# EAGLE design sensorring (EAGLE 6.3)
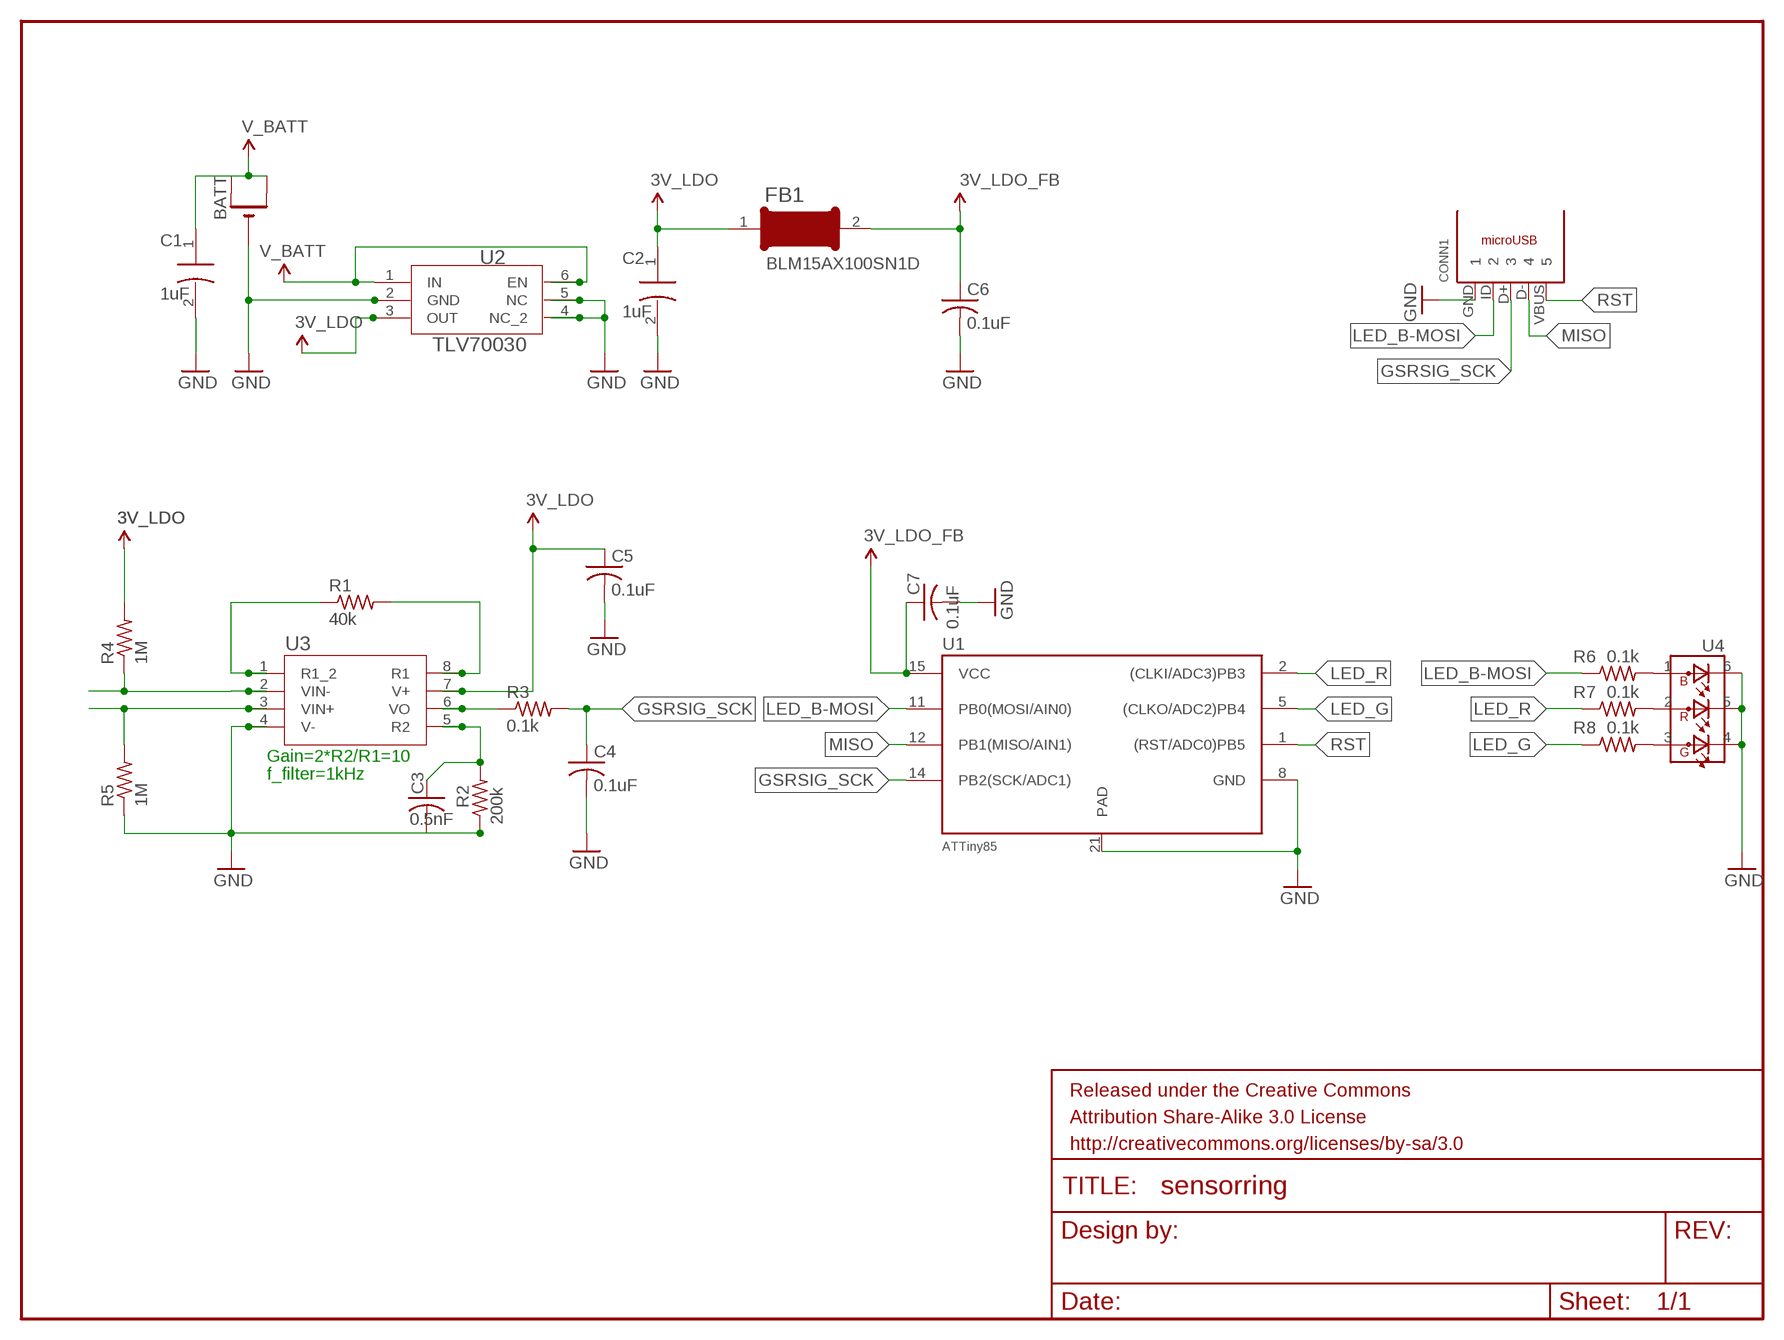
[diagram p0: schematic, sheet 1]

## Parts
BATT  CR2032SMT  [CR2032-SMD]
C1  1uF  C_1005  [C1005]
C2  1uF  C_1005  [C1005]
C3  0.5nF  C-USC0402  [C0402]
C4  0.1uF  C-USC0402  [C0402]
C5  0.1uF  C-USC0402  [C0402]
C6  0.1uF  C-USC0402  [C0402]
C7  0.1uF  C-USC0402  [C0402]
CONN1  USB-MICRO-B  [USB-MICROB]
FB1  BLM15AX100SN1D  FERRITE  [0402]
FRAME1  FRAME-LETTER  [CREATIVE_COMMONS]
R1  40k  R-US_R0402  [R0402]
R2  200k  R-US_R0402  [R0402]
R3  0.1k  R-US_R0402  [R0402]
R4  1M  R-US_R0402  [R0402]
R5  1M  R-US_R0402  [R0402]
R6  0.1k  R-US_R0402  [R0402]
R7  0.1k  R-US_R0402  [R0402]
R8  0.1k  R-US_R0402  [R0402]
U1  ATTiny85  ATTINY85  [20M1]
U2  TLV70030  TLV70028_DSE_6  [DSE6]
U3  INA337_DGK_8  [DGK8]
U4  PICOLED-RGB-1MMX1MM5  [PICOLED-1MM_1MM5]

## Nets
3V_LDO: C2.1 C5.1 FB1.1 R4.2 U2.3(OUT) U3.7(V+)
3V_LDO_FB: C6.1 C7.1 FB1.2 U1.15(VCC) ; supply symbol labelled 3V_LDO
GND: BATT.- C1.2 C2.2 C3.2 C4.2 C5.2 C6.2 C7.2 CONN1.GND R2.1 R5.1 U1.8(GND) U1.21(PAD) U2.2(GND) U2.4(NC_2) U2.5(NC) U3.4(V-) U4.4(A_G) U4.5(A_R) U4.6(A_B)
GSRSIG_SCK: C4.1 CONN1.D+ R3.2 U1.14(PB2(SCK/ADC1))
LED_B-MOSI: CONN1.ID R6.1 U1.11(PB0(MOSI/AIN0))
LED_G: R8.1 U1.5((CLKO/ADC2)PB4)
LED_R: R7.1 U1.2((CLKI/ADC3)PB3)
MISO: CONN1.D- U1.12(PB1(MISO/AIN1))
N$1: R5.2 U3.3(VIN+)
N$2: R3.1 U3.6(VO)
N$3: R6.2 U4.1(C_B)
N$4: R1.2 U3.8(R1)
N$5: R1.1 U3.1(R1_2)
N$7: R7.2 U4.2(C_R)
N$8: R8.2 U4.3(C_G)
N$9: C3.1 R2.2 U3.5(R2)
N$12: R4.1 U3.2(VIN-)
RST: CONN1.VBUS U1.1((RST/ADC0)PB5)
V_BATT: BATT.+$1(+) BATT.+$2(+1) C1.1 U2.1(IN) U2.6(EN)

## Notes on the sheet
- Gain=2*R2/R1=10
- f_filter=1kHz

## Library data of the parts
BATT = adafruit:CR2032
C1 C2 = dps_library:C_1005
C3-C7 = adafruit:C-US: CAPACITOR, American symbol
CONN1 = dps_library:USB-MICRO-B: MICRO USB Type B Hirose Electronics - Datasheet http://www.farnell.com/datasheets/81390.pdf
FB1 = dps_library:FERRITE: Ferrite Bead Eg - http://www.digikey.com/product-detail/en/BLM15AX100SN1D/490-5437-1-ND/2256881
FRAME1 = SparkFun-Aesthetics:FRAME-LETTER: Schematic Frame Standard 8.5x11 US Letter frame
R1-R8 = adafruit:R-US_: RESISTOR, American symbol
U1 = dps_library:ATTINY85: ATtiny25/45/85 Atmel 8-bit uC Symbol Note NC pins - 3,4,6,7,9,10,13,16,17,18,19,20.
U2 = dps_library:TLV70028_DSE_6; DATASHEETURL: http://www.ti.com/lit/gpn/TLV70028; DESCRIPTION: 200mA, Low IQ, Low Dropout Regulator for Portables; FAMILY_NAME: SINGLE CHANNEL LDO; GENERIC_PART_NUMBER: TLV70028; INDUSTRY_STD_PKG_TYPE: WSON; MANUFACTURER: Texas Instruments; MANUFACTURER_PART_NUMBER: tlv70028_dse_6; PACKAGE_DESIGNATOR: DSE; PIN_COUNT: 6; VENDOR: Texas Instruments
U3 = dps_library:INA337_DGK_8; DATASHEETURL: http://www.ti.com/lit/gpn/INA337; DESCRIPTION: Wide-Temperature, Precision Instrumentation Amplifier; FAMILY_NAME: SINGLE SUPPLY; GENERIC_PART_NUMBER: INA337; INDUSTRY_STD_PKG_TYPE: MSOP; MANUFACTURER: Texas Instruments; MANUFACTURER_PART_NUMBER: ina337_dgk_8; PACKAGE_DESIGNATOR: DGK; PIN_COUNT: 8; VENDOR: Texas Instruments
U4 = dps_library:PICOLED-RGB-1MMX1MM5: Rohm Semi PICO LED RGB 1mm x 1.5mm, 5mA current

## Net classes
0 default: width 0.127 mm, drill 0.127 mm, clearance 0.127 mm

## Board
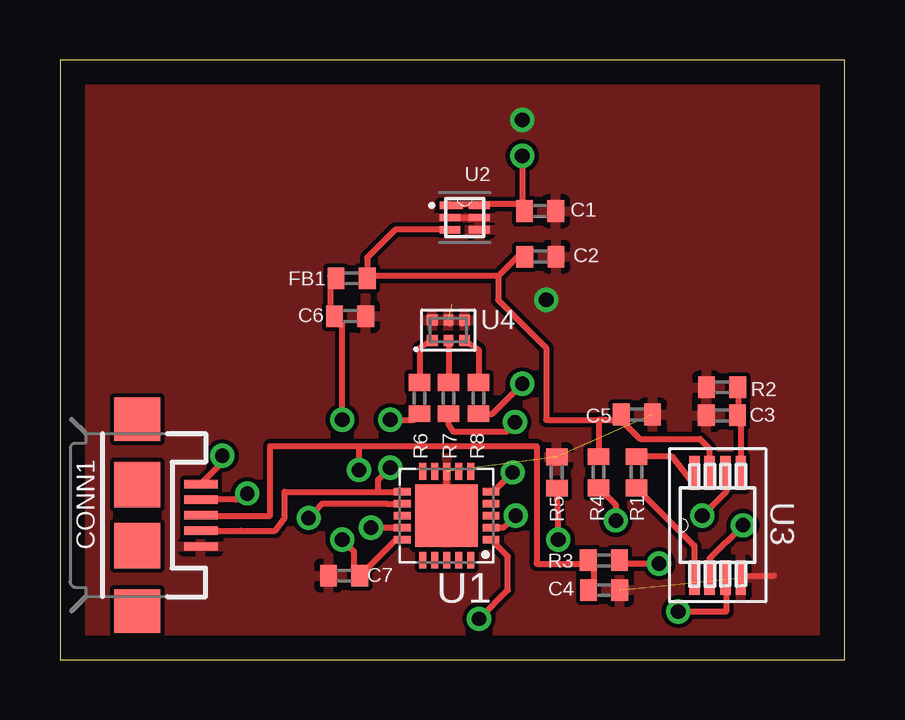
[diagram p1: board, top side]
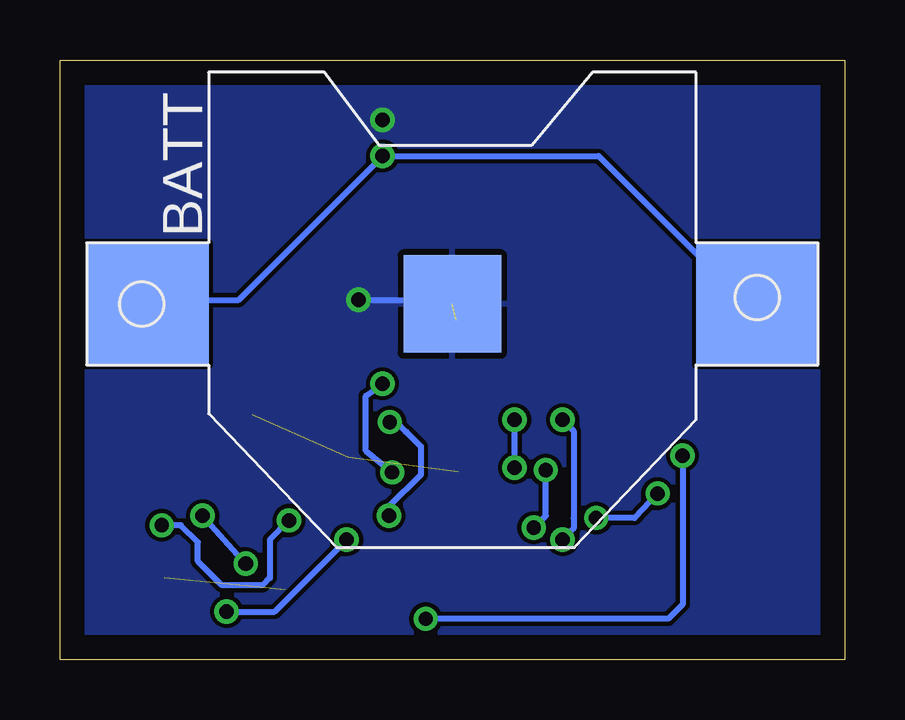
[diagram p2: board, bottom side, seen from below]

Size 32.7 x 25 mm. Coordinates in mm from the lower left corner, seen from the top.
Outline: 0,0 32.7,0 32.7,25 0,25 0,0
Copper layers (1*16): Top 0.035mm / dielectric 1.5mm / Bottom 0.035mm
Design rules "default *": minimum track width 10mil, minimum drill 20mil, track to track 7mil, track to pad 7mil, pad to pad 7mil, via to via 7mil, smd to smd 7mil, copper to edge 40mil, drill to drill 8mil, minimum pad ring 10mil, minimum via ring 8mil, stop-mask expansion 4mil, vias tented up to drill 0mil, thermal gap 10mil

### Footprints (pad centres in the part's own frame; a part is rotated, then mirrored left to right if it is on the bottom)
CR2032-SMD = smd 5.08 x 5.08: +$1 -12.7,0; +$2 12.7,0 | smd 4.064 x 4.064: - 0,0
C1005 = smd 0.7 x 0.9: 1 -0.65,0; 2 0.65,0
C0402 = smd 0.7 x 0.9: 1 -0.65,0; 2 0.65,0
USB-MICROB = smd 1.4 x 0.35: D+ -2.65,0; D- -2.65,-0.65; GND -2.65,1.3; ID -2.65,0.65; VBUS -2.65,-1.3 | smd 1.9 x 1.8: MT1 0,-4; MT2 0,4 | smd 1.9 x 1.9: P$1 0,-1.27; P$2 0,1.27
0402 = smd 0.7 x 0.9: 1 -0.65,0; 2 0.65,0
R0402 = smd 0.7 x 0.9: 1 -0.65,0; 2 0.65,0
20M1 = smd 0.7 x 0.3: 1 -1.85,1; 2 -1.85,0.5; 3 -1.85,0; 4 -1.85,-0.5; 5 -1.85,-1; 11 1.85,-1; 12 1.85,-0.5; 13 1.85,0; 14 1.85,0.5; 15 1.85,1 | smd 0.3 x 0.7: 6 -1,-1.85; 7 -0.5,-1.85; 8 0,-1.85; 9 0.5,-1.85; 10 1,-1.85; 16 1,1.85; 17 0.5,1.85; 18 0,1.85; 19 -0.5,1.85; 20 -1,1.85 | smd 2.6 x 2.6: 21 0,0
DSE6 = smd 0.965 x 0.305: 1 -0.559,0.508 | smd 0.864 x 0.305: 2 -0.61,0; 3 -0.61,-0.508; 4 0.61,-0.508; 5 0.61,0; 6 0.61,0.508
DGK8 = smd 1.422 x 0.432: 1 -2.184,0.965; 2 -2.184,0.33; 3 -2.184,-0.33; 4 -2.184,-0.965; 5 2.184,-0.965; 6 2.184,-0.33; 7 2.184,0.33; 8 2.184,0.965
PICOLED-1MM_1MM5 = smd 0.45 x 0.45: 1 -0.675,-0.425; 3 0.675,-0.425; 4 0.675,0.425; 6 -0.675,0.425 | smd 0.4 x 0.45: 2 0,-0.425; 5 0,0.425

### Placement (x,y rotation side)
BATT  16.35,14.83 0 bottom
C1  20,18.7 0 top
C2  20.02,16.8 0 top
C3  27.58,10.18 180 top
C4  22.67,2.9 0 top
C5  24.04,10.22 0 top
C6  12.09,14.32 0 top
C7  11.84,3.5 180 top
CONN1  3.22,6.02 180 top
FB1  12.15,15.9 180 top
FRAME1  -7.9,-15.62 90 top  (outside the outline)
R1  24.02,7.81 90 top
R2  27.59,11.35 0 top
R3  22.66,4.14 180 top
R4  22.44,7.81 90 top
R5  20.7,7.8 270 top
R6  14.98,10.9 90 top
R7  16.19,10.9 90 top
R8  17.44,10.9 90 top
U1  16.11,6 180 top
U2  16.86,18.43 0 top
U3  27.4,5.6 90 top
U4  16.18,13.73 0 top

### Tracks (layer width: path | path; a pad name or v marks a point on that pad's centre or on a via)
3V_LDO
  Top 0.254: 22.44,10 20.26,10 20.26,13 18.26,15 18.26,16 | 22.44,10 22.76,10 | 22.76,10 23.26,10 C5.1 | 18.26,16 19.26,17 C2.1 | 22.76,10 22.44,10 | 22.44,10 R4.2 | 18.26,16 12.76,16 FB1.1 12.8,16.76 13.96,17.92 U2.3 | U3.7 27.07,8.29 27.06,8.3 27.06,8.8 26.66,9.2 24.16,9.2 23.36,10 22.76,10 | 22.44,10 22.76,10
3V_LDO_FB  (via drill 0.61)
  Top 0.254: FB1.2 11.26,16 11.26,14 C6.1 11.76,14 v11.76,10 | U1.15 13.99,5 C7.1 12.26,3.5 12.26,4.5 v11.76,5
  Bottom 0.254: v11.76,10 11.3,9.54 11.3,5.9 11.3,5.46 v11.76,5
GND  (via drill 0.61)  (4 unrouted)
  Top 0.254: 16.84,14.15 16.76,14 U4.4 | U1.21 U1.8 | U2.2 U2.5 | U3.4 28.45,3.5 29.76,3.5 | 16.26,14 U4.5 16.26,14
  Bottom 0.254: v20.26,15 17.26,15 BATT.-
  other vias: 19.26,22.5
  pour Top: -1,26 34,26 34,-1 -1,-1
  pour Bottom: -0.8,25.5 33.4,25.5 33.4,-0.3 -0.8,-0.3 -0.8,-0.2 -0.8,25.4
GSRSIG_SCK  (via drill 0.6)
  Top 0.254: 22.26,4 22.26,3 C4.1 | 22.26,4 R3.2 22.26,4 | 22.26,4 19.86,4 19.86,8.3 19.86,8.9 12.46,8.9 | 12.46,8.9 8.76,8.9 8.76,6 6.46,6 CONN1.D+ | U1.14 v12.96,5.5 | v12.46,7.9 12.46,8.9
  Bottom 0.254: v12.96,5.5 12.46,6 v12.46,7.9
LED_B-MOSI  (via drill 0.61)
  Top 0.254: CONN1.ID 7.53,5.37 8.96,5.37 9.36,5.9 9.36,7 13.26,7 | 13.26,7 U1.11 | v13.76,10 14.76,10 R6.1 | v13.76,8 13.26,7.5 13.26,7
  Bottom 0.254: v13.76,8 v13.76,10
LED_G  (via drill 0.6)
  Top 0.254: R8.1 18.01,10.25 v19.26,11.5 | v18.86,7.8 18.06,7 U1.5
  Bottom 0.254: v18.86,7.8 19.96,8.7 19.96,11 v19.26,11.5
LED_R  (via drill 0.6)
  Top 0.254: v18.99,6 18.46,5.5 U1.2 | v18.96,9.9 18.6,9.5 16.4,9.5 16.19,9.81 R7.1
  Bottom 0.254: v18.99,6 18.99,6.41 17.66,7.7 17.66,8.89 18.27,9.5 18.3,9.5 18.7,9.9 v18.96,9.9
MISO  (via drill 0.6)
  Top 0.254: 5.9,6.7 CONN1.D- 7.33,6.67 v7.8,6.92 | v10.36,5.9 10.94,6.5 13.58,6.5 13.6,6.5 U1.12
  Bottom 0.254: v7.8,6.92 8.76,5.9 v10.36,5.9
N$1  (via drill 0.61)
  Top 0.254: v20.76,5 20.76,6 R5.2 | v25.76,2 27.76,2 27.76,3 U3.3
  Bottom 0.254: v20.76,5 23.76,2 v25.76,2
N$2  (via drill 0.61)
  Top 0.254: v24.96,4 23.26,4 R3.1 | v26.76,6 27.76,7 27.76,7.5 U3.6
  Bottom 0.254: v26.76,6 v24.96,4
N$3
  Top 0.254: U4.1 14.98,12.98 R6.2
N$4
  Top 0.254: R1.2 25.5,8.46 26.26,7.5 U3.8
N$5
  Top 0.254: R1.1 26.43,4.75 U3.1
N$7
  Top 0.254: U4.2 R7.2
N$8
  Top 0.254: U4.3 17.44,12.92 R8.2
N$9
  Top 0.254: 28.26,10 28.26,11 R2.2 | 28.26,10 C3.1 | 28.26,10 28.36,9.89 U3.5
N$12  (via drill 0.6)
  Top 0.254: R4.1 23.16,6.44 v23.16,5.8 | v28.46,5.6 27.07,4.21 U3.2
  Bottom 0.254: v23.16,5.8 23.96,5 23.96,3.4 24.26,3.1 25.96,3.1 26.96,4.1 26.96,4.9 27.66,5.6 v28.46,5.6
RST  (via drill 0.6)
  Top 0.254: CONN1.VBUS 6.76,8.21 v6.76,8.5 | v17.46,1.7 18.66,2.9 18.66,4.3 U1.1
  Bottom 0.254: v6.76,8.5 6.76,2.3 7.36,1.7 v17.46,1.7
V_BATT  (via drill 0.61)
  Top 0.254: v19.26,21 19.26,19 | 19.26,19 C1.1 19.26,19 | 17.26,19 16.26,19 U2.1 | 17.26,19 U2.6 17.26,19 | 19.26,19 17.26,19
  Bottom 0.254: BATT.+$1 28.26,15 25.26,15 v19.26,21 10.26,21 4.26,15 BATT.+$2